# Altium schematic sheet Hpowerv2.SchDoc
size A4; SheetNumber: 1; SheetTotal: 1
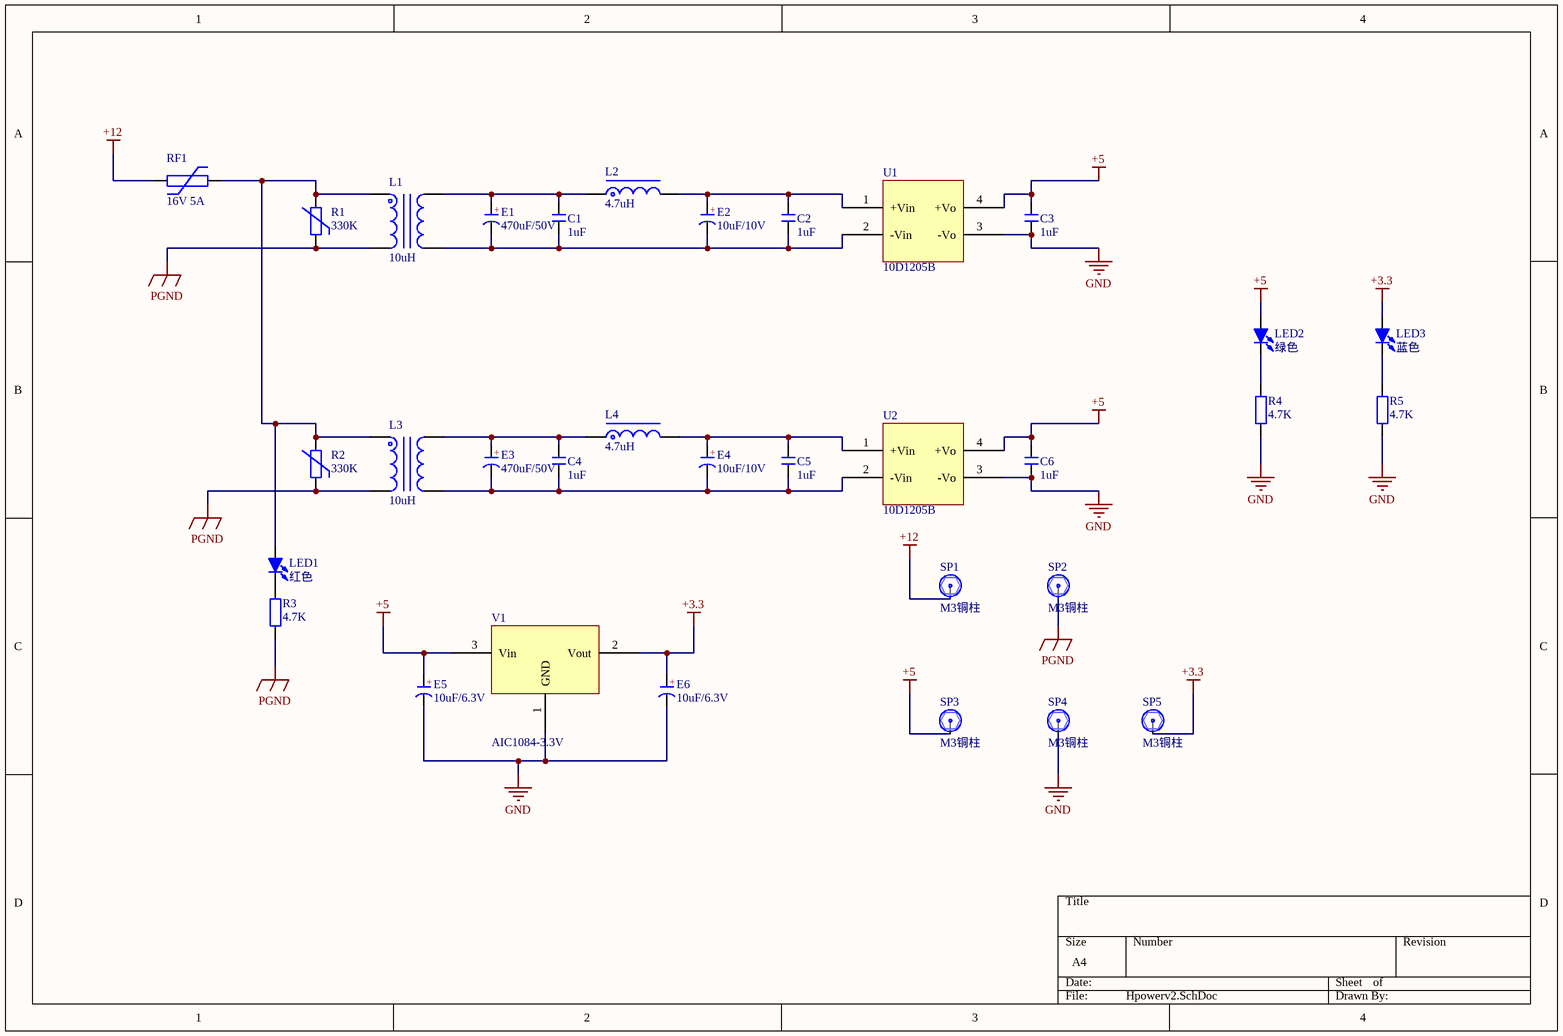
[diagram p0: Hpowerv2.SchDoc]

## Parts
C1  1uF  [CC 2.2*5]
C2  1uF  [CC 2.2*5]
C3  1uF  [CC 2.2*5]
C4  1uF  [CC 2.2*5]
C5  1uF  [CC 2.2*5]
C6  1uF  [CC 2.2*5]
E1  470uF/50V  [CM G(12.5*13.5)]
E2  10uF/10V  [CM G(12.5*13.5)]
E3  470uF/50V  [CM G(12.5*13.5)]
E4  10uF/10V  [CM G(12.5*13.5)]
E5  10uF/6.3V  [CD A(3216)]
E6  10uF/6.3V  [CD A(3216)]
L1  10uH  [UU9.8]
L2  4.7uH  [NR5020]
L3  10uH  [UU9.8]
L4  4.7uH  [NR5020]
LED1  红色  [LED 0603R]
LED2  绿色  [LED 0603G]
LED3  蓝色  [LED 0603B]
R1  330K  [14D]
R2  330K  [14D]
R3  4.7K  [R 0603_M]
R4  4.7K  [R 0603_M]
R5  4.7K  [R 0603_M]
RF1  16V 5A  [14D]
SP1  M3铜柱  [M3x14_N]
SP2  M3铜柱  [M3x14_N]
SP3  M3铜柱  [M3x14_N]
SP4  M3铜柱  [M3x14_N]
SP5  M3铜柱  [M3x14_N]
U1  10D1205B  [10D12B-10WDCDC]
U2  10D1205B  [10D12B-10WDCDC]
V1  AIC1084-3.3V  [TO263-3B]

## Nets
+3.3: E6.1(A) LED3.1(A) SP5.1 V1.2(Vout)
+5: C3.1 C6.1 E5.1(A) LED2.1(A) SP3.1 U1.4(+Vo) U2.4(+Vo) V1.3(Vin)
+12: RF1.1 SP1.1
GND: C3.2 C6.2 E5.2(K) E6.2(K) R4.1 R5.1 SP4.1 U1.3(-Vo) U2.3(-Vo) V1.1(GND)
PGND: L1.2 L3.2 R1.1 R2.1 R3.1 SP2.1
NetC1_1: C1.1 E1.1(A) L1.4 L2.1
NetC1_2: C1.2 C2.2 E1.2(K) E2.2(K) L1.3 U1.2(-Vin)
NetC2_1: C2.1 E2.1(A) L2.2 U1.1(+Vin)
NetC4_1: C4.1 E3.1(A) L3.4 L4.1
NetC4_2: C4.2 C5.2 E3.2(K) E4.2(K) L3.3 U2.2(-Vin)
NetC5_1: C5.1 E4.1(A) L4.2 U2.1(+Vin)
NetL1_1: L1.1 L3.1 LED1.1(A) R1.2 R2.2 RF1.2
NetLED1_2: LED1.2(K) R3.2
NetLED2_2: LED2.2(K) R4.2
NetLED3_2: LED3.2(K) R5.2

## Notes on the sheet
- (in symbol C-CD) +
- (in symbol C-CM) +

## Library data of the parts
C1-C6 = C-CC: 直插瓷片电容; 版权归属: 源创客; BOM名称: 直插瓷片电容; 学习资源: www.ooocke.com
E1-E4 = C-CM: 贴片电解电容; 版权归属: 源创客; BOM名称: 贴片电解电容; 学习资源: www.ooocke.com
E5 E6 = C-CD: 贴片钽电容; 版权归属: 源创客; BOM名称: 贴片钽电容; 学习资源: www.ooocke.com
L1 L3 = L-CMC: 共模电感; 版权归属: 源创客; BOM名称: 共模电感; 学习资源: www.ooocke.com
L2 L4 = L-NR: NR磁胶电感; 版权归属: 源创客; BOM名称: NR磁胶电感; 学习资源: www.ooocke.com
LED1-LED3 = LED-SMD: 贴片LED; 版权归属: 源创客; BOM名称: 贴片LED; 学习资源: www.ooocke.com
R1 R2 = R_VDR: 压敏电阻; 版权归属: 源创客; BOM名称: 压敏电阻; 学习资源: www.ooocke.com
R3-R5 = R: 贴片电阻; 版权归属: 源创客; BOM名称: 贴片电阻; 学习资源: www.ooocke.com
RF1 = PPTC: PPTC自恢复保险丝; 版权归属: 源创客; BOM名称: PPTC自恢复保险丝; 学习资源: www.ooocke.com
SP1-SP5 = 铜柱大焊盘: 铜柱; 版权归属: 源创客; BOM名称: 铜柱; 学习资源: www.ooocke.com
U1 U2 = 10D1205B: DC-DC 12V转5V隔离降压模块
V1 = AIC1084: 大功率LDO